# Altium schematic sheet SCH1_Power.SchDoc: Power
size B; Organization: CWRUbotix; Address1: 10900 Euclid Avenue; Address2: Cleveland, OH 44106; Address3: USA; Revision: 1.0; SheetNumber: 1; SheetTotal: 13
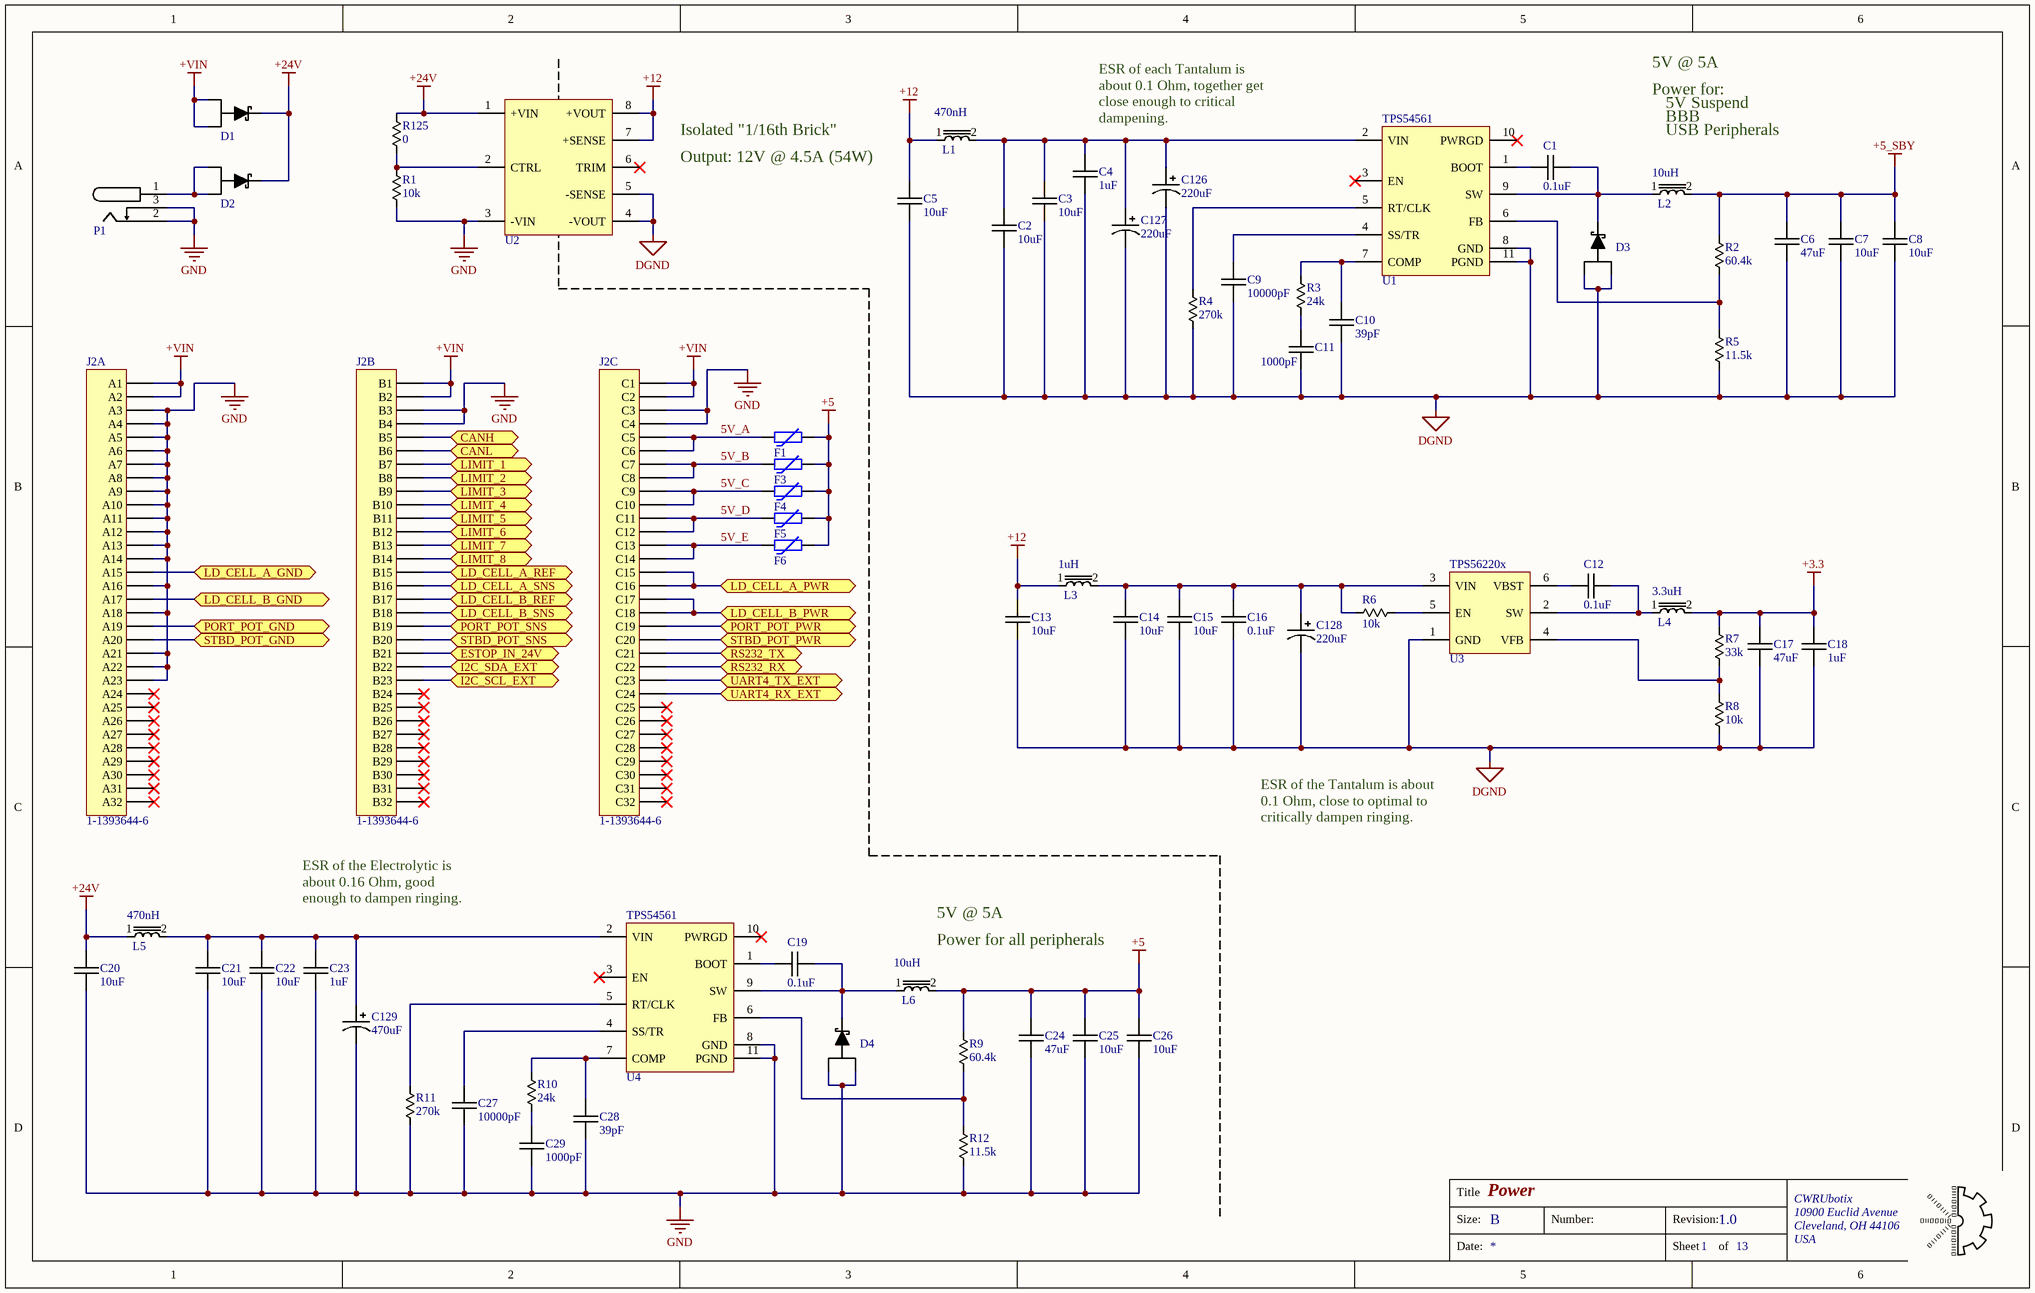
[diagram p0: SCH1_Power.SchDoc]

## Parts
C1  0.1uF  [chip_0603]
C2  10uF  [chip_1206]
C3  10uF  [chip_1206]
C4  1uF  [chip_0805]
C5  10uF  [chip_1206]
C6  47uF  [chip_1210]
C7  10uF  [chip_1206]
C8  10uF  [chip_1206]
C9  10000pF  [chip_0603]
C10  39pF  [chip_0603]
C11  1000pF  [chip_0603]
C12  0.1uF  [chip_0603]
C13  10uF  [chip_1206]
C14  10uF  [chip_1206]
C15  10uF  [chip_1206]
C16  0.1uF  [chip_0603]
C17  47uF  [chip_1210]
C18  1uF  [chip_0805]
C19  0.1uF  [chip_0603]
C20  10uF  [chip_1206]
C21  10uF  [chip_1206]
C22  10uF  [chip_1206]
C23  1uF  [chip_0805]
C24  47uF  [chip_1210]
C25  10uF  [chip_1206]
C26  10uF  [chip_1206]
C27  10000pF  [chip_0603]
C28  39pF  [chip_0603]
C29  1000pF  [chip_0603]
C126  220uF  [chip_2917_KEMET_T495]
C127  220uF  [chip_2917_KEMET_T495]
C128  220uF  [chip_2917_KEMET_T495]
C129  470uF  [CAP_SMD_10x10_0]
D1  diode_sch_A12C3  [TO-277-3]  (value not drawn)
D2  diode_sch_A12C3  [TO-277-3]  (value not drawn)
D3  diode_sch_A12C3  [TO-277-3]  (value not drawn)
D4  diode_sch_A12C3  [TO-277-3]  (value not drawn)
F1  PTC_0  [chip_1206]  (value not drawn)
F3  PTC_0  [chip_1206]  (value not drawn)
F4  PTC_0  [chip_1206]  (value not drawn)
F5  PTC_0  [chip_1206]  (value not drawn)
F6  PTC_0  [chip_1206]  (value not drawn)
J2  1-1393644-6  [TE_CONN_1-1393644-6]  (parts A,B,C of 3)
L1  Inductance: 470nH  [CHIP_1008_IND]  (hidden comment: ind_1)
L2  Inductance: 10uH  [VISHAY_IHLP3232DZ]  (hidden comment: ind_1)
L3  Inductance: 1uH  [chip_0805]  (hidden comment: ind_1)
L4  Inductance: 3.3uH  [BOURNS_SRN5040]  (hidden comment: ind_1)
L5  Inductance: 470nH  [CHIP_1008_IND]  (hidden comment: ind_1)
L6  Inductance: 10uH  [VISHAY_IHLP3232DZ]  (hidden comment: ind_1)
P1  conn-barrel_0  [SWITCHCRAFT_RAPC722X]  (value not drawn)
R1  10k  [chip_0603]
R2  60.4k  [chip_0805]
R3  24k  [chip_0603]
R4  270k  [chip_0603]
R5  11.5k  [chip_0805]
R6  10k  [chip_0603]
R7  33k  [chip_0603]
R8  10k  [chip_0603]
R9  60.4k  [chip_0805]
R10  24k  [chip_0603]
R11  270k  [chip_0603]
R12  11.5k  [chip_0805]
R125  0  [chip_0805]
U1  TPS54561  [WSON-10_0]
U2  UWS-12/4.5-Q48N-C  [MURATA_UWS]  (value not drawn)
U3  TPS56220x  [sot-23-6]
U4  TPS54561  [WSON-10_0]

## Ports
CANH (bidir), CANL (bidir), ESTOP_IN_24V (bidir), I2C_SCL_EXT (bidir), I2C_SDA_EXT (bidir), LD_CELL_A_GND (bidir), LD_CELL_A_PWR (bidir), LD_CELL_A_REF (bidir), LD_CELL_A_SNS (bidir), LD_CELL_B_GND (bidir), LD_CELL_B_PWR (bidir), LD_CELL_B_REF (bidir), LD_CELL_B_SNS (bidir), LIMIT_1 (bidir), LIMIT_2 (bidir), LIMIT_3 (bidir), LIMIT_4 (bidir), LIMIT_5 (bidir), LIMIT_6 (bidir), LIMIT_7 (bidir), LIMIT_8 (bidir), PORT_POT_GND (bidir), PORT_POT_PWR (bidir), PORT_POT_SNS (bidir), RS232_RX (bidir), RS232_TX (bidir), STBD_POT_GND (bidir), STBD_POT_PWR (bidir), STBD_POT_SNS (bidir), UART4_RX_EXT (bidir), UART4_TX_EXT (bidir)

## Nets
+3.3: C17.1 C18.1 L4.2 R7.1
+5: C24.1 C25.1 C26.1 F1.2 F3.2 F4.2 F5.2 F6.2 L6.2 R9.1
+5_SBY: C6.1 C7.1 C8.1 L2.2 R2.1
+12: C5.1 C13.1 L1.1 L3.1 U2.7(+SENSE) U2.8(+VOUT)
+24V: C20.1 D1.3 D2.3 L5.1 R125.2 U2.1(+VIN)
+VIN: D1.1 D1.2 J2.A1 J2.A2 J2.B1 J2.B2 J2.C1 J2.C2
DGND: C2.2 C3.2 C4.2 C5.2 C6.2 C7.2 C8.2 C9.2 C10.2 C11.2 C13.2 C14.2 C15.2 C16.2 C17.2 C18.2 C126.2 C127.2 C128.2 D3.1 D3.2 R4.2 R5.2 R8.2 U1.8(GND) U1.11(PGND) U2.4(-VOUT) U2.5(-SENSE) U3.1(GND)
GND: C20.2 C21.2 C22.2 C23.2 C24.2 C25.2 C26.2 C27.2 C28.2 C29.2 C129.2 D4.1 D4.2 J2.A3 J2.A4 J2.A5 J2.A6 J2.A7 J2.A8 J2.A9 J2.A10 J2.A11 J2.A12 J2.A13 J2.A14 J2.A16 J2.A18 J2.A21 J2.A22 J2.A23 J2.B3 J2.B4 J2.C3 J2.C4 P1.2(GND) P1.3 R1.2 R11.2 R12.2 U2.3(-VIN) U4.8(GND) U4.11(PGND)
5V_A: F1.1 J2.C5 J2.C6
5V_B: F3.1 J2.C7 J2.C8
5V_C: F4.1 J2.C9 J2.C10
5V_D: F5.1 J2.C11 J2.C12
5V_E: F6.1 J2.C13 J2.C14
CANH: J2.B5 ; port CANH
CANL: J2.B6 ; port CANL
ESTOP_IN_24V: J2.B21 ; port ESTOP_IN_24V
I2C_SCL_EXT: J2.B23 ; port I2C_SCL_EXT
I2C_SDA_EXT: J2.B22 ; port I2C_SDA_EXT
LD_CELL_A_GND: J2.A15 ; port LD_CELL_A_GND
LD_CELL_A_PWR: J2.C15 J2.C16 ; port LD_CELL_A_PWR
LD_CELL_A_REF: J2.B15 ; port LD_CELL_A_REF
LD_CELL_A_SNS: J2.B16 ; port LD_CELL_A_SNS
LD_CELL_B_GND: J2.A17 ; port LD_CELL_B_GND
LD_CELL_B_PWR: J2.C17 J2.C18 ; port LD_CELL_B_PWR
LD_CELL_B_REF: J2.B17 ; port LD_CELL_B_REF
LD_CELL_B_SNS: J2.B18 ; port LD_CELL_B_SNS
LIMIT_1: J2.B7 ; port LIMIT_1
LIMIT_2: J2.B8 ; port LIMIT_2
LIMIT_3: J2.B9 ; port LIMIT_3
LIMIT_4: J2.B10 ; port LIMIT_4
LIMIT_5: J2.B11 ; port LIMIT_5
LIMIT_6: J2.B12 ; port LIMIT_6
LIMIT_7: J2.B13 ; port LIMIT_7
LIMIT_8: J2.B14 ; port LIMIT_8
PORT_POT_GND: J2.A19 ; port PORT_POT_GND
PORT_POT_PWR: J2.C19 ; port PORT_POT_PWR
PORT_POT_SNS: J2.B19 ; port PORT_POT_SNS
RS232_RX: J2.C22 ; port RS232_RX
RS232_TX: J2.C21 ; port RS232_TX
STBD_POT_GND: J2.A20 ; port STBD_POT_GND
STBD_POT_PWR: J2.C20 ; port STBD_POT_PWR
STBD_POT_SNS: J2.B20 ; port STBD_POT_SNS
UART4_RX_EXT: J2.C24 ; port UART4_RX_EXT
UART4_TX_EXT: J2.C23 ; port UART4_TX_EXT
NetC1_1: C1.1 U1.1(BOOT)
NetC1_2: C1.2 D3.3 L2.1 U1.9(SW)
NetC2_1: C2.1 C3.1 C4.1 C126.1 C127.1 L1.2 U1.2(VIN)
NetC9_1: C9.1 U1.4(SS/TR)
NetC10_1: C10.1 R3.1 U1.7(COMP)
NetC11_1: C11.1 R3.2
NetC12_1: C12.1 U3.6(VBST)
NetC12_2: C12.2 L4.1 U3.2(SW)
NetC14_1: C14.1 C15.1 C16.1 C128.1 L3.2 R6.2 U3.3(VIN)
NetC19_1: C19.1 U4.1(BOOT)
NetC19_2: C19.2 D4.3 L6.1 U4.9(SW)
NetC21_1: C21.1 C22.1 C23.1 C129.1 L5.2 U4.2(VIN)
NetC27_1: C27.1 U4.4(SS/TR)
NetC28_1: C28.1 R10.1 U4.7(COMP)
NetC29_1: C29.1 R10.2
NetD2_1: D2.1 D2.2 P1.1(VCC)
NetR1_1: R1.1 R125.1 U2.2(CTRL)
NetR2_2: R2.2 R5.1 U1.6(FB)
NetR4_1: R4.1 U1.5(RT/CLK)
NetR6_1: R6.1 U3.5(EN)
NetR7_2: R7.2 R8.1 U3.4(VFB)
NetR9_2: R9.2 R12.1 U4.6(FB)
NetR11_1: R11.1 U4.5(RT/CLK)

Not connected (* = marked no-connect by the designer): J2 A24* A25* A26* A27* A28* A29* A30* A31* A32* B24* B25* B26* B27* B28* B29* B30* B31* B32* C25* C26* C27* C28* C29* C30* C31* C32*; U1 3(EN)* 10(PWRGD)*; U2 6(TRIM)*; U4 3(EN)* 10(PWRGD)*

## Notes on the sheet
- 5V @ 5A
- Power for:
- Isolated "1/16th Brick"
- (near C5) Output: 12V @ 4.5A (54W)
- ESR of each Tantalum is about 0.1 Ohm, together get close enough to critical dampening.
- 5V Suspend
- BBB
- USB Peripherals
- ESR of the Tantalum is about 0.1 Ohm, close to optimal to critically dampen ringing.
- ESR of the Electrolytic is about 0.16 Ohm, good enough to dampen ringing.
- (near L6) Power for all peripherals
- Title
- Size:
- B
- Number:
- Revision:
- Date:
- Sheet
- of

## Library data of the parts
C1 C12 C16 C19 = CAP-00542: CAP, 0.1uF, ±10%, 16V, X7R, 0603; Manufacturer: Murata; Part Number: CAP-00542; Capacitance: 0.1uF; Tolerance: ±10%; Voltage Rating: 16V; Type: X7R
C2 C3 C5 C7 C8 C13-C15 C20-C22 C25 C26 = CAP-00539: CAP, 10uF, ±10%, 25V, X7R, 1206; Manufacturer: Samsung; Manufacturer PN: CL31B106KAHNNNE; Part Number: CAP-00539; Capacitance: 10uF; Tolerance: ±10%; Voltage Rating: 25V; Type: X7R
C4 C18 C23 = CAP-00110: CAP, 1uF, 10%, 16V, X7R, 0805; Manufacturer: Murata; Manufacturer PN: GRM21BR71C105KA01K; Part Number: CAP-00110; Capacitance: 1uF; Tolerance: 10%; Voltage Rating: 16V; Type: X7R
C6 C17 C24 = CAP-00557: CAP, 47uF, ±20%, 6.3V, X7R, 1210; Manufacturer: KEMET; Manufacturer PN: C1210C476M9RACTU; Part Number: CAP-00557; Capacitance: 47uF; Tolerance: ±20%; Voltage Rating: 6.3V; Type: X7R; Cost: $1.08
C9 C27 = CAP-00543: CAP, 10000pF, ±10%, 16V, X7R, 0603; Part Number: CAP-00543; Capacitance: 10000pF; Tolerance: ±10%; Voltage Rating: 16V; Type: X7R
C10 C28 = CAP-00423: CAP, 39pF, ±1%, 50V, C0G, 0603; Manufacturer: Murata; Manufacturer PN: GRM1885C1H390FA01D; Part Number: CAP-00423; Capacitance: 39pF; Tolerance: ±1%; Voltage Rating: 50V; Type: C0G
C11 C29 = CAP-00457: CAP, 1000pF, ±1%, 50V, C0G, 0603; Manufacturer: Murata; Manufacturer PN: GRM1885C1H102FA01D; Part Number: CAP-00457; Capacitance: 1000pF; Tolerance: ±1%; Voltage Rating: 50V; Type: C0G
C126-C128 = CAP-00584: CAP, 220uF, ±10%, 16V, Tantalum, 100mOhm, 2917; Manufacturer: KEMET; Manufacturer PN: T495X227K016ATE100; Part Number: CAP-00584; Capacitance: 220uF; Tolerance: ±10%; Voltage Rating: 16V; Type: Tantalum; Cost: $2.57
C129 = CAP-00558: CAP, 470uF, ±20%, 25V, Al, SMD, 7000hrs at 105°C; Manufacturer: Nichicon; Manufacturer PN: UCW1E471MNL1GS; Part Number: CAP-00558; Capacitance: 470uF; Tolerance: ±20%; Voltage Rating: 25V; Type: Al; Cost: $0.70
D1-D4 = DIO-00074: Dio, Schottky, 5A, 0.63V, 60V, TO-227; Manufacturer: Vishay; Manufacturer PN: SS5P6-M3/86A; Part Number: DIO-00074; Forward Voltage: 0.63V; Reverse Breakdown Voltage: 60V; Current Rating: 5A; Type: Schottky; Cost: 0.6
F1 F3-F6 = MISC-00008: PTC Resettable fuse, 6V, 500mA, 1206; Manufacturer: Eaton; Manufacturer PN: PTS12066V050; Part Number: MISC-00008; Cost: 0.3
J2 = CONN-00084: DIN 41612 Plug, 96-Pos, Male Pins, Right-Angle; Manufacturer: TE Connectivity; Positions per level: 32; Levels: 3; Part Number: CONN-00084; Type: Plug; Manufacturer PN: 1-1393644-6; Cost: 7.49
L1 L5 = MAG-00124: Ind, 470nH, 4A, 0.027 Ohm, 1008; Manufacturer: Murata; Manufacturer PN: DFE252012P-R47M=P2; Tolerance: 20%; Test Freq: 1MHz; DCR: 27mOhm; Part Number: MAG-00124; Current Rating: 4A; Cost: 0.51
L2 L6 = MAG-00106: Ind, 10uH, 20%, 5.2A (9A sat.), 0.0599 Ohm; Manufacturer: Vishay Dale; Manufacturer PN: IHLP3232DZER100M01; DCR: 59.9mOhm; Part Number: MAG-00106; Tolerance: 20%; Current Rating: 5.2A; Cost: 1.65
L3 = MAG-00019: Ind, 1uH, 20%, 900mA, 0805; Manufacturer: TDK; Manufacturer PN: MLZ2012A1R0WTD25; DCR: 130 mOhm; Part Number: MAG-00019; Tolerance: 20%; Current Rating: 900mA
L4 = MAG-00111: Ind, 3.3uH, 3.3A (3.8A sat.), 0.027 Ohm; Manufacturer: Bourns; Manufacturer PN: SRN5040-3R3M; Tolerance: 20%; DCR: 27mOhm; Part Number: MAG-00111; Current Rating: 3.3A; Cost: 0.46
P1 = CONN-00074: Barrel Jack, 2.0x5.5mm IDxOD, Right-Angle; Manufacturer: Switchcraft; Manufacturer PN: RAPC722X; Positions per level: 3; Levels: 1; Part Number: CONN-00074; Type: Barrel Jack; Cost: 1.64
R1 R6 R8 = RES-00306: RES SMD 10K OHM 1% 1/4W 0603; Manufacturer: Panasonic; Manufacturer PN: ERJ-PA3F1002V; Power Rating: 0.25W; Part Number: RES-00306; Resistance: 10k; Tolerance: 1%; Cost: 0.144
R2 R9 = RES-00531: RES SMD 60.4K OHM 1% 1/8W 0805; Manufacturer: Rohm Semiconductor; Manufacturer PN: KTR10EZPF6042; Power Rating: 0.125W; Part Number: RES-00531; Resistance: 60.4k; Tolerance: 1%
R3 R10 = RES-00399: RES SMD 24K OHM 1% 1/4W 0603; Manufacturer: Panasonic; Manufacturer PN: ERJ-PA3F2402V; Power Rating: 0.25W; Part Number: RES-00399; Resistance: 24k; Tolerance: 1%
R4 R11 = RES-00405: RES SMD 270K OHM 1% 1/4W 0603; Manufacturer: Panasonic; Manufacturer PN: ERJ-PA3F2703V; Power Rating: 0.25W; Part Number: RES-00405; Resistance: 270k; Tolerance: 1%
R5 R12 = RES-00309: RES SMD 11.5K OHM 1% 1/8W 0805; Manufacturer: Rohm Semiconductor; Manufacturer PN: KTR10EZPF1152; Power Rating: 0.125W; Part Number: RES-00309; Resistance: 11.5k; Tolerance: 1%
R7 = RES-00442: RES SMD 33K OHM 1% 1/4W 0603; Manufacturer: Panasonic; Manufacturer PN: ERJ-PA3F3302V; Power Rating: 0.25W; Part Number: RES-00442; Resistance: 33k; Tolerance: 1%
R125 = RES-00720: RES SMD 0 OHM 1/8W 0805 Thick Film; Manufacturer: Stackpole; Manufacturer PN: RMCF0805ZT0R00; Tolerance: Jumper; Part Number: RES-00720; Resistance: 0; Power Rating: 1/8W; Cost: 0.1
U1 U4 = PWREG-00033: REG, SW Buck Adj, 5A, 4.5-60V, 2.5MHz, TPS54561; Manufacturer: TI; Manufacturer PN: TPS54561DPRR; Voltage Range Out: 0.8-58.8V; Frequency: 100kHz-2.5MHz; Reg Type: SW Buck; Part Number: PWREG-00033; Voltage Range In: 4.5-60V; Max Current: 5A; Fixed/Adj: Adj; Cost: 5.52
U2 = PWREG-00058: Module, Isolated, 1/16 Brick, 12V 4.5A (54W) Negative Logic; Manufacturer: Murata; Voltage Range In: 18 ~ 75V; Reg Type: Isolated Module; Fixed/Adj: Fixed; Part Number: PWREG-00058; Voltage Range Out: 12V; Max Current: 4.5A; Manufacturer PN: UWS-12/4.5-Q48N-C; Cost: 32
U3 = PWREG-00040: REG, Synchronous Buck, 2A, 4.5-17V Input, SOT-23-6, TPS562201; Manufacturer: TI; Manufacturer PN: TPS562201DDCR; Voltage Range Out: 0.76 - 7V; Frequency: 580kHz; Reg Type: SW Buck; Fixed/Adj: Adj; Part Number: PWREG-00040; Voltage Range In: 4.5 - 17V; Max Current: 2A; Cost: 0.68